# EAGLE schematic DAC (EAGLE 9.4.2)
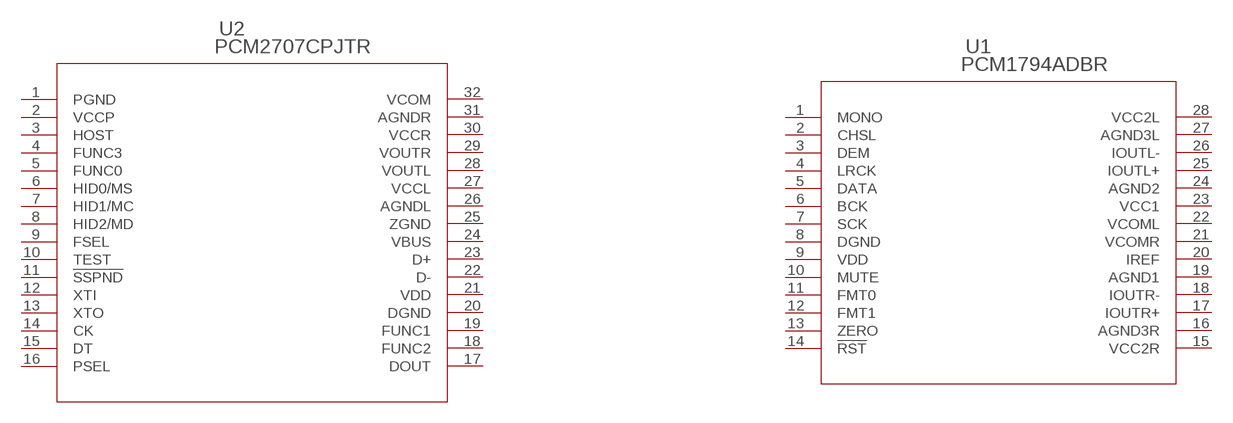
[diagram p0: schematic, sheet 1]

## Parts
U1  PCM1794ADBR  [DB28]
U2  PCM2707CPJTR  [PJT32]
Unconnected: U1.1(MONO) U1.2(CHSL) U1.3(DEM) U1.4(LRCK) U1.5(DATA) U1.6(BCK) U1.7(SCK) U1.10(MUTE) U1.11(FMT0) U1.12(FMT1) U1.13(ZERO) U1.14(!RST) U1.17(IOUTR+) U1.18(IOUTR-) U1.25(IOUTL+) U1.26(IOUTL-) U2.3(HOST) U2.4(FUNC3) U2.5(FUNC0) U2.6(HID0/MS) U2.7(HID1/MC) U2.8(HID2/MD) U2.9(FSEL) U2.10(TEST) U2.11(!SSPND) U2.12(XTI) U2.13(XTO) U2.14(CK) U2.15(DT) U2.16(PSEL) U2.17(DOUT) U2.18(FUNC2) U2.19(FUNC1) U2.22(D-) U2.23(D+) U2.28(VOUTL) U2.29(VOUTR)

## Power pins joined to a net without a drawn wire
AGND1: U1.19(AGND1)
AGND2: U1.24(AGND2)
AGND3L: U1.27(AGND3L)
AGND3R: U1.16(AGND3R)
AGNDL: U2.26(AGNDL)
AGNDR: U2.31(AGNDR)
DGND: U1.8(DGND) U2.20(DGND)
IREF: U1.20(IREF)
PGND: U2.1(PGND)
VBUS: U2.24(VBUS)
VCC1: U1.23(VCC1)
VCC2L: U1.28(VCC2L)
VCC2R: U1.15(VCC2R)
VCCL: U2.27(VCCL)
VCCP: U2.2(VCCP)
VCCR: U2.30(VCCR)
VCOM: U2.32(VCOM)
VCOML: U1.22(VCOML)
VCOMR: U1.21(VCOMR)
VDD: U1.9(VDD) U2.21(VDD)
ZGND: U2.25(ZGND)

## Library data of the parts
U1 = DAC_parts:PCM1794ADBR; MANUFACTURER_PART_NUMBER: PCM1794ADBR; VENDOR: Texas Instruments
U2 = DAC_parts:PCM2707CPJTR; MANUFACTURER_PART_NUMBER: PCM2707CPJTR; VENDOR: Texas Instruments